# Altium schematic sheet Raspberry Pi CM4.SchDoc
size A3; SheetNumber: 7; SheetTotal: 22
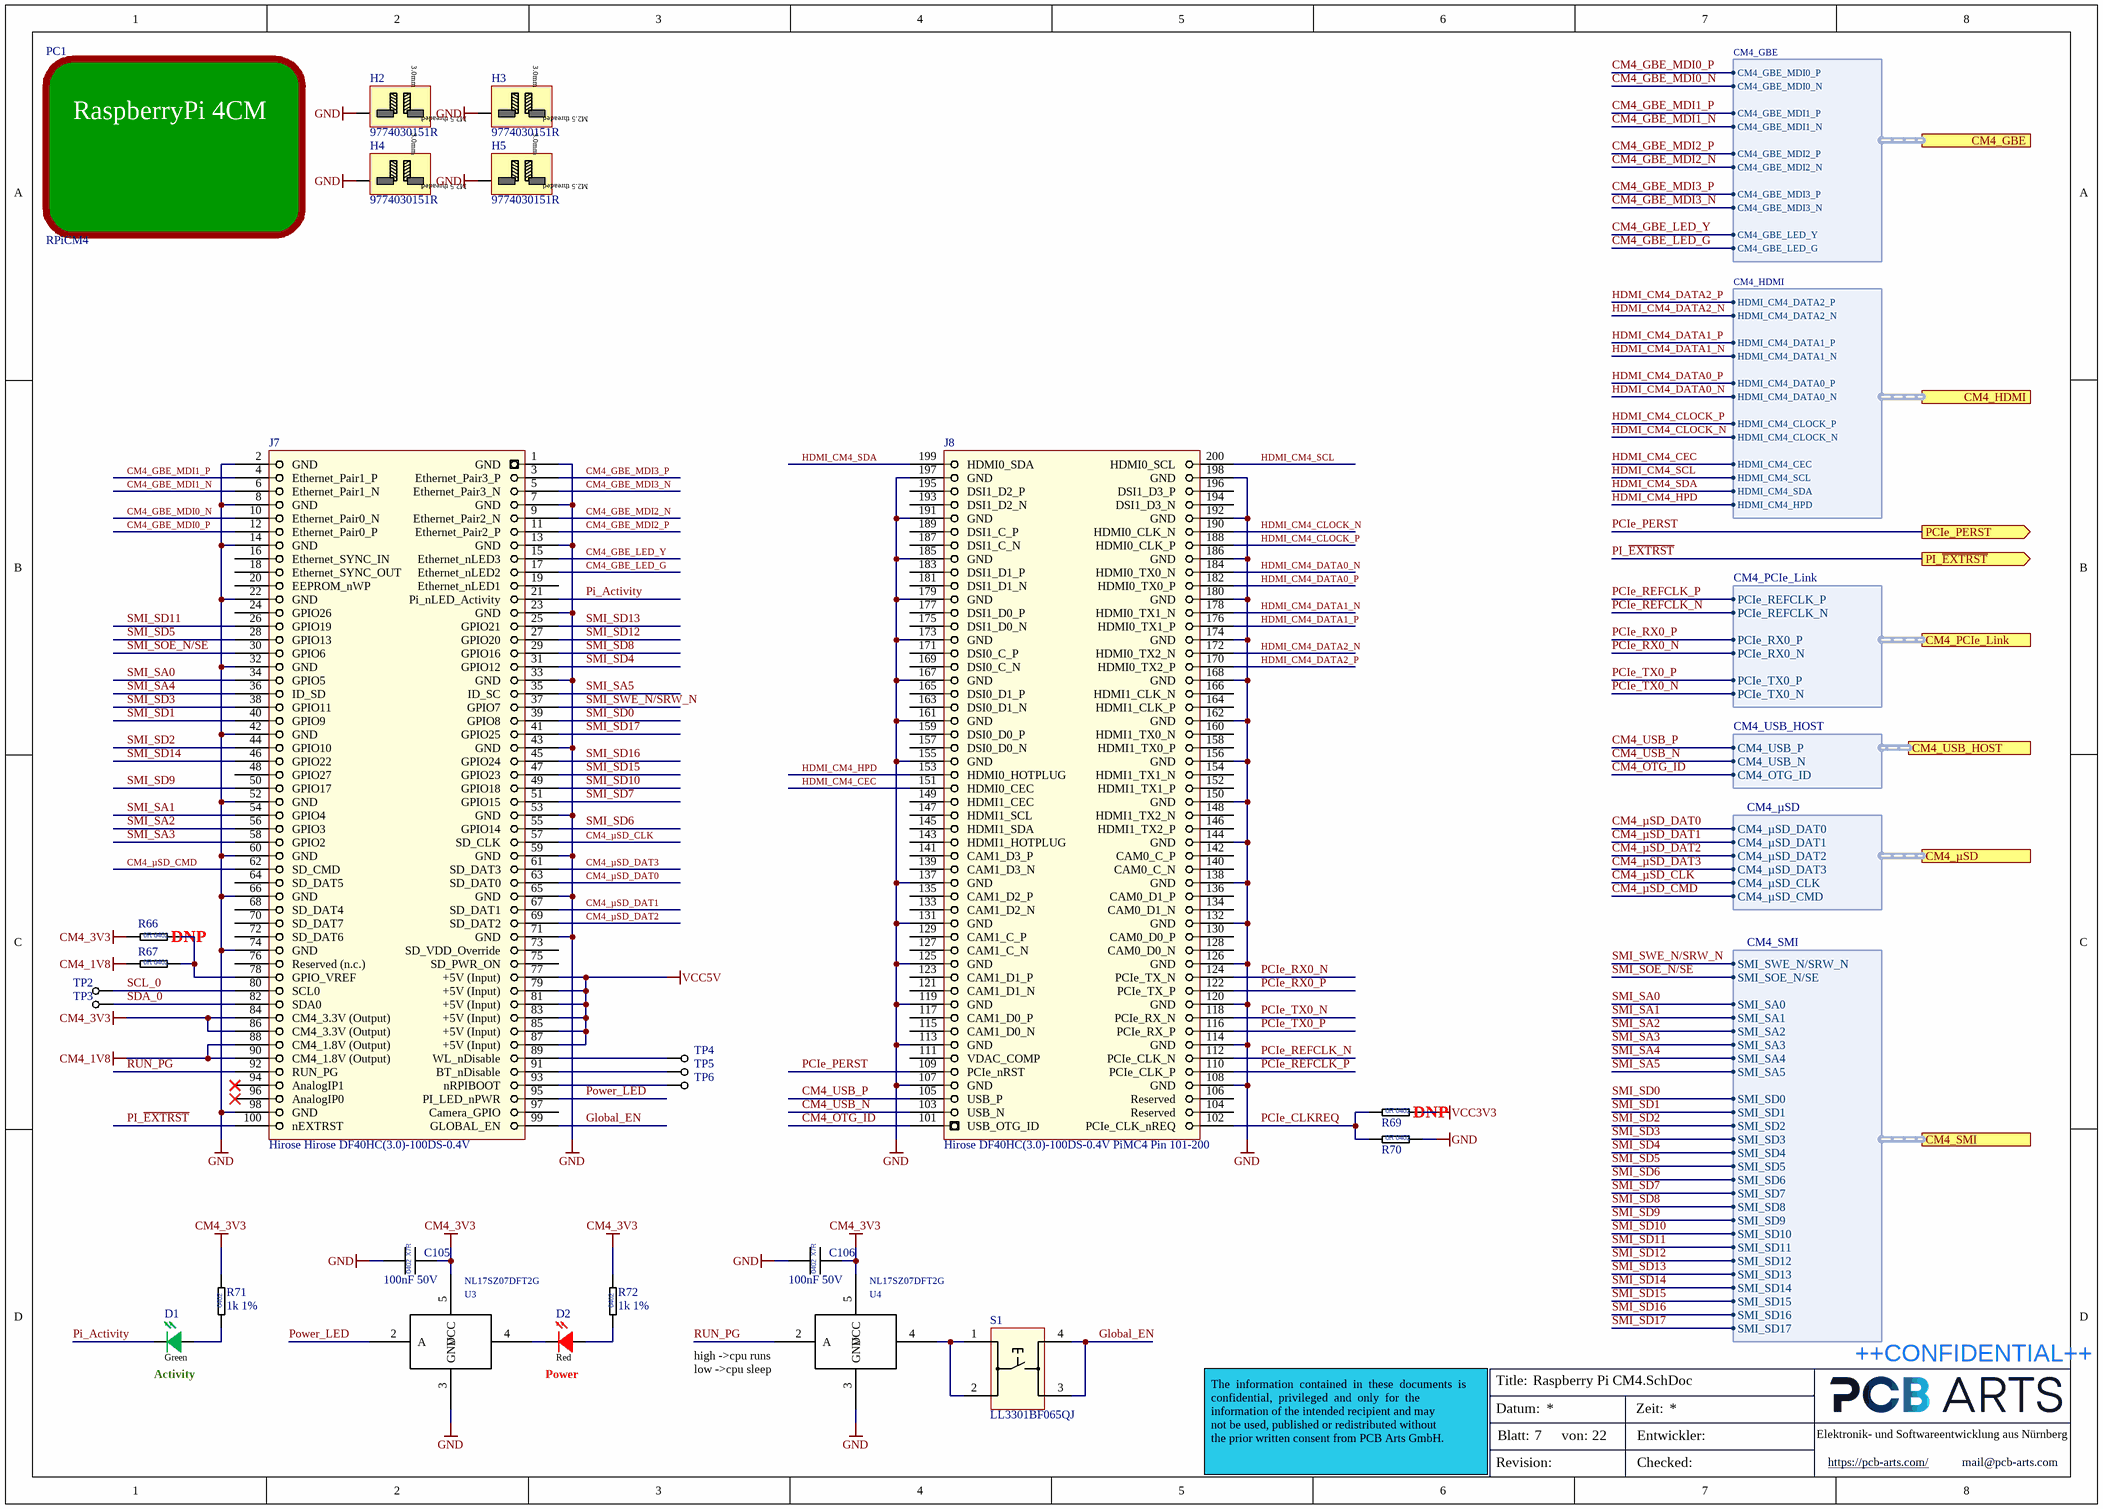
[diagram p0: Raspberry Pi CM4.SchDoc]

## Parts
C105  100nF 50V  [CAP_0402_L]
C106  100nF 50V  [CAP_0402_L]
D1  Color: Green  [LED-0603 Sideview]  (hidden comment: LTST-S270KGKT)
D2  Color: Red  [LED-0603 Sideview]  (hidden comment: LTST-S270KRKT)
H2  9774030151R  [9774030151R]
H3  9774030151R  [9774030151R]
H4  9774030151R  [9774030151R]
H5  9774030151R  [9774030151R]
J7  Hirose Hirose DF40HC(3.0)-100DS-0.4V  [Hirose DF40HC(3.0)-100DS-0.4V_1-100]
J8  Hirose DF40HC(3.0)-100DS-0.4V PiMC4 Pin 101-200  [Hirose DF40HC(3.0)-100DS-0.4V_101-200]
PC1  RPiCM4  [RaspberryPi_CM4]
R66  0R Jumper  [RES_0402_L]  (value not drawn)  (no BOM)
R67  0R Jumper  [RES_0402_L]  (value not drawn)
R69  0R Jumper  [RES_0402_L]  (value not drawn)  (no BOM)
R70  0R Jumper  [RES_0402_L]  (value not drawn)
R71  1k 1%  [RES_0402_L]
R72  1k 1%  [RES_0402_L]
S1  LL3301BF065QJ  [LL3301BF065QJ]
TP2  Testpoint  [Testpoint 0.8mm]  (value not drawn)  (no BOM)
TP3  Testpoint  [Testpoint 0.8mm]  (value not drawn)  (no BOM)
TP4  Testpoint  [Testpoint 0.8mm]  (value not drawn)  (no BOM)
TP5  Testpoint  [Testpoint 0.8mm]  (value not drawn)  (no BOM)
TP6  Testpoint  [Testpoint 0.8mm]  (value not drawn)  (no BOM)
U3  NL17SZ07DFT2G  [SOT65P210X110-5N]
U4  NL17SZ07DFT2G  [SOT65P210X110-5N]

## Ports
CM4_GBE (harness CM4_GBE, see Top-Level-Sheet[4C], Raspberry Pi CM4_Periphery[1A]), CM4_HDMI (harness CM4_HDMI, see Top-Level-Sheet[4C], Raspberry Pi CM4_Periphery[1C]), CM4_PCIe_Link (harness CM4_PCIe_Link, see Top-Level-Sheet[5C], MGT Banks 115-116[8B]), CM4_SMI (harness CM4_SMI, see Top-Level-Sheet[4C], SMI Bank 12[1A]), CM4_USB_HOST (harness CM4_USB_HOST, see Top-Level-Sheet[4C], USB-HUB-MUX[1A]), CM4_µSD (harness CM4_µSD, see Top-Level-Sheet[4C], Raspberry Pi CM4_Periphery[1D]), PCIe_PERST (out, see Top-Level-Sheet[5C], Bank 13_Bank 15_Bank 16[8A]), PI_~{EXTRST} (out, see Top-Level-Sheet[5C], Bank 13_Bank 15_Bank 16[8A])

## Harnesses
CM4_GBE: CM4_GBE_MDI0_P, CM4_GBE_MDI0_N, CM4_GBE_MDI1_P, CM4_GBE_MDI1_N, CM4_GBE_MDI2_P, CM4_GBE_MDI2_N, CM4_GBE_MDI3_P, CM4_GBE_MDI3_N, CM4_GBE_LED_Y, CM4_GBE_LED_G
CM4_HDMI: HDMI_CM4_DATA2_P, HDMI_CM4_DATA2_N, HDMI_CM4_DATA1_P, HDMI_CM4_DATA1_N, HDMI_CM4_DATA0_P, HDMI_CM4_DATA0_N, HDMI_CM4_CLOCK_P, HDMI_CM4_CLOCK_N, HDMI_CM4_CEC, HDMI_CM4_SCL, HDMI_CM4_SDA, HDMI_CM4_HPD
CM4_PCIe_Link: PCIe_REFCLK_P, PCIe_REFCLK_N, PCIe_RX0_P, PCIe_RX0_N, PCIe_TX0_P, PCIe_TX0_N
CM4_USB_HOST: CM4_USB_P, CM4_USB_N, CM4_OTG_ID
CM4_µSD: CM4_µSD_DAT1, CM4_µSD_DAT2, CM4_µSD_DAT3, CM4_µSD_CLK, CM4_µSD_DAT0, CM4_µSD_CMD
CM4_SMI: SMI_SOE_N/SE, SMI_SA0, SMI_SD0, SMI_SWE_N/SRW_N, SMI_SA1, SMI_SA2, SMI_SA3, SMI_SA4, SMI_SA5, SMI_SD1, SMI_SD2, SMI_SD3, SMI_SD4, SMI_SD5, SMI_SD6, SMI_SD7, SMI_SD8, SMI_SD9, SMI_SD10, SMI_SD11, SMI_SD12, SMI_SD13, SMI_SD14, SMI_SD15, SMI_SD16, SMI_SD17

## Nets
CM4_1V8: J7.88(CM4_1.8V_(Output)) J7.90(CM4_1.8V_(Output)) R67.1
CM4_3V3: C105.2 C106.2 J7.84(CM4_3.3V_(Output)) J7.86(CM4_3.3V_(Output)) R66.1 R71.2 R72.2 U3.5(VCC) U4.5(VCC)
GND: C105.1 C106.1 H2.1 H3.1 H4.1 H5.1 J7.1(GND) J7.2(GND) J7.7(GND) J7.8(GND) J7.13(GND) J7.14(GND) J7.22(GND) J7.23(GND) J7.32(GND) J7.33(GND) J7.42(GND) J7.43(GND) J7.52(GND) J7.53(GND) J7.59(GND) J7.60(GND) J7.65(GND) J7.66(GND) J7.71(GND) J7.74(GND) J7.98(GND) J8.107(GND) J8.108(GND) J8.113(GND) J8.114(GND) J8.119(GND) J8.120(GND) J8.125(GND) J8.126(GND) J8.131(GND) J8.132(GND) J8.137(GND) J8.138(GND) J8.144(GND) J8.150(GND) J8.155(GND) J8.156(GND) J8.161(GND) J8.162(GND) J8.167(GND) J8.168(GND) J8.173(GND) J8.174(GND) J8.179(GND) J8.180(GND) J8.185(GND) J8.186(GND) J8.191(GND) J8.192(GND) J8.197(GND) J8.198(GND) R70.2 U3.3(GND) U4.3(GND)
VCC3V3: R69.2
VCC5V: J7.77(+5V_(Input)) J7.79(+5V_(Input)) J7.81(+5V_(Input)) J7.83(+5V_(Input)) J7.85(+5V_(Input)) J7.87(+5V_(Input))
CM4_GBE_LED_G: J7.17(Ethernet_nLED2) ; port CM4_GBE.CM4_GBE_LED_G
CM4_GBE_LED_Y: J7.15(Ethernet_nLED3) ; port CM4_GBE.CM4_GBE_LED_Y
CM4_GBE_MDI0_N: J7.10(Ethernet_Pair0_N) ; port CM4_GBE.CM4_GBE_MDI0_N
CM4_GBE_MDI0_P: J7.12(Ethernet_Pair0_P) ; port CM4_GBE.CM4_GBE_MDI0_P
CM4_GBE_MDI1_N: J7.6(Ethernet_Pair1_N) ; port CM4_GBE.CM4_GBE_MDI1_N
CM4_GBE_MDI1_P: J7.4(Ethernet_Pair1_P) ; port CM4_GBE.CM4_GBE_MDI1_P
CM4_GBE_MDI2_N: J7.9(Ethernet_Pair2_N) ; port CM4_GBE.CM4_GBE_MDI2_N
CM4_GBE_MDI2_P: J7.11(Ethernet_Pair2_P) ; port CM4_GBE.CM4_GBE_MDI2_P
CM4_GBE_MDI3_N: J7.5(Ethernet_Pair3_N) ; port CM4_GBE.CM4_GBE_MDI3_N
CM4_GBE_MDI3_P: J7.3(Ethernet_Pair3_P) ; port CM4_GBE.CM4_GBE_MDI3_P
CM4_OTG_ID: J8.101(USB_OTG_ID) ; port CM4_USB_HOST.CM4_OTG_ID
CM4_USB_N: J8.103(USB_N) ; port CM4_USB_HOST.CM4_USB_N
CM4_USB_P: J8.105(USB_P) ; port CM4_USB_HOST.CM4_USB_P
CM4_µSD_CLK: J7.57(SD_CLK) ; port CM4_µSD.CM4_µSD_CLK
CM4_µSD_CMD: J7.62(SD_CMD) ; port CM4_µSD.CM4_µSD_CMD
CM4_µSD_DAT0: J7.63(SD_DAT0) ; port CM4_µSD.CM4_µSD_DAT0
CM4_µSD_DAT1: J7.67(SD_DAT1) ; port CM4_µSD.CM4_µSD_DAT1
CM4_µSD_DAT2: J7.69(SD_DAT2) ; port CM4_µSD.CM4_µSD_DAT2
CM4_µSD_DAT3: J7.61(SD_DAT3) ; port CM4_µSD.CM4_µSD_DAT3
Global_EN: J7.99(GLOBAL_EN) S1.3 S1.4
HDMI_CM4_CEC: J8.151(HDMI0_CEC) ; port CM4_HDMI.HDMI_CM4_CEC
HDMI_CM4_CLOCK_N: J8.190(HDMI0_CLK_N) ; port CM4_HDMI.HDMI_CM4_CLOCK_N
HDMI_CM4_CLOCK_P: J8.188(HDMI0_CLK_P) ; port CM4_HDMI.HDMI_CM4_CLOCK_P
HDMI_CM4_DATA0_N: J8.184(HDMI0_TX0_N) ; port CM4_HDMI.HDMI_CM4_DATA0_N
HDMI_CM4_DATA0_P: J8.182(HDMI0_TX0_P) ; port CM4_HDMI.HDMI_CM4_DATA0_P
HDMI_CM4_DATA1_N: J8.178(HDMI0_TX1_N) ; port CM4_HDMI.HDMI_CM4_DATA1_N
HDMI_CM4_DATA1_P: J8.176(HDMI0_TX1_P) ; port CM4_HDMI.HDMI_CM4_DATA1_P
HDMI_CM4_DATA2_N: J8.172(HDMI0_TX2_N) ; port CM4_HDMI.HDMI_CM4_DATA2_N
HDMI_CM4_DATA2_P: J8.170(HDMI0_TX2_P) ; port CM4_HDMI.HDMI_CM4_DATA2_P
HDMI_CM4_HPD: J8.153(HDMI0_HOTPLUG) ; port CM4_HDMI.HDMI_CM4_HPD
HDMI_CM4_SCL: J8.200(HDMI0_SCL) ; port CM4_HDMI.HDMI_CM4_SCL
HDMI_CM4_SDA: J8.199(HDMI0_SDA) ; port CM4_HDMI.HDMI_CM4_SDA
PCIe_CLKREQ: J8.102(PCIe_CLK_nREQ) R69.1 R70.1
PCIe_PERST: J8.109(PCIe_nRST) ; port PCIe_PERST
PCIe_REFCLK_N: J8.112(PCIe_CLK_N) ; port CM4_PCIe_Link.PCIe_REFCLK_N
PCIe_REFCLK_P: J8.110(PCIe_CLK_P) ; port CM4_PCIe_Link.PCIe_REFCLK_P
PCIe_RX0_N: J8.124(PCIe_TX_N) ; port CM4_PCIe_Link.PCIe_RX0_N
PCIe_RX0_P: J8.122(PCIe_TX_P) ; port CM4_PCIe_Link.PCIe_RX0_P
PCIe_TX0_N: J8.118(PCIe_RX_N) ; port CM4_PCIe_Link.PCIe_TX0_N
PCIe_TX0_P: J8.116(PCIe_RX_P) ; port CM4_PCIe_Link.PCIe_TX0_P
Pi_Activity: D1.1 J7.21(Pi_nLED_Activity)
PI_~{EXTRST}: J7.100(nEXTRST) ; port PI_~{EXTRST}
Power_LED: J7.95(PI_LED_nPWR) U3.2(A)
RUN_PG: J7.92(RUN_PG) U4.2(A)
SCL_0: J7.80(SCL0) TP2.1(GND)
SDA_0: J7.82(SDA0) TP3.1(GND)
SMI_SA0: J7.34(GPIO5) ; port CM4_SMI.SMI_SA0
SMI_SA1: J7.54(GPIO4) ; port CM4_SMI.SMI_SA1
SMI_SA2: J7.56(GPIO3) ; port CM4_SMI.SMI_SA2
SMI_SA3: J7.58(GPIO2) ; port CM4_SMI.SMI_SA3
SMI_SA4: J7.36(ID_SD) ; port CM4_SMI.SMI_SA4
SMI_SA5: J7.35(ID_SC) ; port CM4_SMI.SMI_SA5
SMI_SD0: J7.39(GPIO8) ; port CM4_SMI.SMI_SD0
SMI_SD1: J7.40(GPIO9) ; port CM4_SMI.SMI_SD1
SMI_SD2: J7.44(GPIO10) ; port CM4_SMI.SMI_SD2
SMI_SD3: J7.38(GPIO11) ; port CM4_SMI.SMI_SD3
SMI_SD4: J7.31(GPIO12) ; port CM4_SMI.SMI_SD4
SMI_SD5: J7.28(GPIO13) ; port CM4_SMI.SMI_SD5
SMI_SD6: J7.55(GPIO14) ; port CM4_SMI.SMI_SD6
SMI_SD7: J7.51(GPIO15) ; port CM4_SMI.SMI_SD7
SMI_SD8: J7.29(GPIO16) ; port CM4_SMI.SMI_SD8
SMI_SD9: J7.50(GPIO17) ; port CM4_SMI.SMI_SD9
SMI_SD10: J7.49(GPIO18) ; port CM4_SMI.SMI_SD10
SMI_SD11: J7.26(GPIO19) ; port CM4_SMI.SMI_SD11
SMI_SD12: J7.27(GPIO20) ; port CM4_SMI.SMI_SD12
SMI_SD13: J7.25(GPIO21) ; port CM4_SMI.SMI_SD13
SMI_SD14: J7.46(GPIO22) ; port CM4_SMI.SMI_SD14
SMI_SD15: J7.47(GPIO23) ; port CM4_SMI.SMI_SD15
SMI_SD16: J7.45(GPIO24) ; port CM4_SMI.SMI_SD16
SMI_SD17: J7.41(GPIO25) ; port CM4_SMI.SMI_SD17
SMI_SOE_N/SE: J7.30(GPIO6) ; port CM4_SMI.SMI_SOE_N/SE
SMI_SWE_N/SRW_N: J7.37(GPIO7) ; port CM4_SMI.SMI_SWE_N/SRW_N
NetD1_2: D1.2 R71.1
NetD2_1: D2.1 U3.4(Y)
NetD2_2: D2.2 R72.1
NetJ7_78: J7.78(GPIO_VREF) R66.2 R67.2
NetJ7_89: J7.89(WL_nDisable) TP4.1(GND)
NetJ7_91: J7.91(BT_nDisable) TP5.1(GND)
NetJ7_93: J7.93(nRPIBOOT) TP6.1(GND)
NetS1_1: S1.1 S1.2 U4.4(Y)

Not connected (* = marked no-connect by the designer): J7 16(Ethernet_SYNC_IN) 18(Ethernet_SYNC_OUT) 19(Ethernet_nLED1) 20(EEPROM_nWP) 24(GPIO26) 48(GPIO27) 64(SD_DAT5) 68(SD_DAT4) 70(SD_DAT7) 72(SD_DAT6) 73(SD_VDD_Override) 75(SD_PWR_ON) 76(Reserved_(n.c.)) 94(AnalogIP1)* 96(AnalogIP0)* 97(Camera_GPIO); J8 104(Reserved) 106(Reserved) 111(VDAC_COMP) 115(CAM1_D0_N) 117(CAM1_D0_P) 121(CAM1_D1_N) 123(CAM1_D1_P) 127(CAM1_C_N) 128(CAM0_D0_N) 129(CAM1_C_P) 130(CAM0_D0_P) 133(CAM1_D2_N) 134(CAM0_D1_N) 135(CAM1_D2_P) 136(CAM0_D1_P) 139(CAM1_D3_N) 140(CAM0_C_N) 141(CAM1_D3_P) 142(CAM0_C_P) 143(HDMI1_HOTPLUG) 145(HDMI1_SDA) 146(HDMI1_TX2_P) 147(HDMI1_SCL) 148(HDMI1_TX2_N) 149(HDMI1_CEC) 152(HDMI1_TX1_P) 154(HDMI1_TX1_N) 157(DSI0_D0_N) 158(HDMI1_TX0_P) 159(DSI0_D0_P) 160(HDMI1_TX0_N) 163(DSI0_D1_N) 164(HDMI1_CLK_P) 165(DSI0_D1_P) 166(HDMI1_CLK_N) 169(DSI0_C_N) 171(DSI0_C_P) 175(DSI1_D0_N) 177(DSI1_D0_P) 181(DSI1_D1_N) 183(DSI1_D1_P) 187(DSI1_C_N) 189(DSI1_C_P) 193(DSI1_D2_N) 194(DSI1_D3_N) 195(DSI1_D2_P) 196(DSI1_D3_P)

## Notes on the sheet
- (near R66) DNP
- (near R69) DNP
- (near D1) Activity
- (near D2) Power
- (near U4) high ->cpu runs
- (near U4) low ->cpu sleep
- Title:
- ++CONFIDENTIAL++
- Datum:
- Blatt:
- von:
- Zeit:
- Entwickler:
- Elektronik- und Softwareentwicklung aus Nürnberg
- The  information  contained  in  these  documents  is  confidential,  privileged  and  only  for  the
  information of the intended recipient and may
  not be used, published or redistributed without
  the prior written consent from PCB Arts GmbH.
- Revision:
- Checked:
- https://pcb-arts.com/
- mail@pcb-arts.com
- (in symbol CAP_0402_100nF_50V) X7R; 0402
- (in symbol Raspberry Pi Compute Module 4) RaspberryPi 4CM
- (in symbol RES_0402_0R Jumper) 0R 0402
- (in symbol RES_0402_1k_1%) 0402
- (in symbol Würth Standoff M2.5 h:3.0mm) 3.0mm; M2.5 threaded

## Library data of the parts
C105 C106 = CAP_0402_100nF_50V: Multilayer Ceramic Capacitors MLCC - SMD/SMT 0402 50VDC; Manufacturer 1: Murata Electronics; Manufacturer 1 Prt. Nr.: GCM155L8EH104KE07D; Manufacturer 2 Prt. Nr.: UMK105B7104KV-FR; Manufacturer 2: TDK
D1 = LED 0603 Green Sideview: GREEN  0603 Light Emitting Diode; Manufacturer 1: lite-On; Manufacturer 1 Prt. Nr.: LTST-S270KGKT
D2 = LED 0603 Red Sideview: RED  0603 Light Emitting Diode; Manufacturer 1: lite-On; Manufacturer 1 Prt. Nr.: LTST-S270KRKT
H2-H5 = Würth Standoff M2.5 h:3.0mm: Würth Standoff M2.5 h:3.0mm 9774030151R; Manufacturer 1: Würth Elektronik; Manufacturer 1 Prt. Nr.: 9774030151R
J7 = DF40HC(3.0)-100DS-0.4V RPiCM4 Pin 1-100: Hirose DF40HC(3.0)-100DS-0.4V 3mm heigth receptacle for Raspberry Pi CM4, Pin 1-100; Manufacturer 1: Hirose; Manufacturer Prt. Nr.: DF40HC(3.0)-100DS-0.4V
J8 = DF40HC(3.0)-100DS-0.4V RPiCM4 Pin 101-200: Hirose DF40C-100DS-0.4V 3mm heigth receptacle for Raspberry Pi CM4, Pin 101-200; Manufacturer 1: Hirose; Manufacturer 1 Prt. Nr.: DF40HC(3.0)-100DS-0.4V
PC1 = Raspberry Pi Compute Module 4: Raspberry Pi 4 Compute Module 4; Manufacturer 1: Raspberry Pi; Manufacturer 1 Prt. Nr.: Compute Module 4
R66 R67 R69 R70 = RES_0402_0R Jumper: Thick Film Resistors - SMD 0Ohm; Manufacturer 1: Vishay / Dale; Manufacturer 1 Prt. Nr.: CRCW04020000Z0EDC; Manufacturer 2 Prt. Nr.: RC0402JR-070RL; Manufacturer 2: Yageo
R71 R72 = RES_0402_1k_1%: Thick Film Resistors - SMD 1kOhm 1%; Manufacturer 1: Vishay / Dale; Manufacturer 1 Prt. Nr.: CRCW04021K00FKEDC; Manufacturer 2 Prt. Nr.: RC0402FR-7W1KL; Manufacturer 2: Yageo
S1 = LL3301BF065QJ_SPST Top Actuated  Button, 65gf, SMD h: 9.8mm: SPST Top Actuated  Button, 65gf, SMD h: 9.8mm; Manufacturer 1: E-Switch; Manufacturer 1 Prt. Nr.: LL3301BF065QJ
TP2-TP6 = Testpoint 0.8mm
U3 U4 = NL17SZ07DFT2G_Buffer 1.65-5.5V Single Non-Inverting: Puffer u. Leitungstreiber 1.65-5.5V Single Non-Inverting; Manufacturer 1: ON Semiconductor; Manufacturer 1 Prt. Nr.: NL17SZ07DFT2G